# EAGLE design Schematique_TEST (EAGLE 7.6.0)
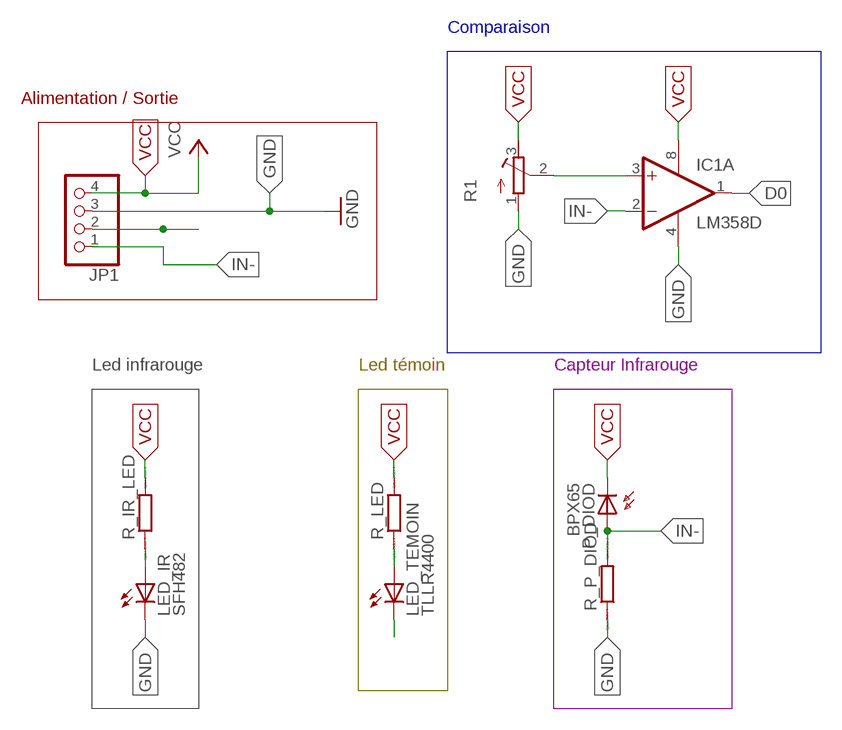
[diagram p0: schematic, sheet 1]

## Parts
IC1  LM358D  [SO08]
JP1  PINHD-1X4M  [1X04M]
LED_IR  SFH482  [SFH482]
LED_TEMOIN  TLLR4400  [LED3MM]
P_DIOD  BPX65  [BPX65]
R1  R-TRIMM4G/J  [RTRIM4G/J]
R_IR_LED  RR1206  [R1206]
R_LED  RR1206  [R1206]
R_P_DIOD  RR1206  [R1206]

## Nets
D0: IC1.1(A:OUT) JP1.2 LED_TEMOIN.K(C)
GND: IC1.4(P:V-) JP1.3 LED_IR.K(C) R1.1(A) R_P_DIOD.1
IN-: IC1.2(A:-IN) JP1.1 P_DIOD.A R_P_DIOD.2
N$1: LED_IR.A R_IR_LED.1
N$2: IC1.3(A:+IN) R1.2(S)
N$4: LED_TEMOIN.A R_LED.1
VCC: IC1.8(P:V+) JP1.4 P_DIOD.K(C) R1.3(E) R_IR_LED.2 R_LED.2
Unconnected: IC1.5(B:+IN) IC1.6(B:-IN) IC1.7(B:OUT)

## Buses
GND

## Notes on the sheet
- Comparaison
- Alimentation / Sortie
- Led infrarouge | Led témoin | Capteur Infrarouge

## Library data of the parts
IC1 = linear:LM358: OP AMP also LM158; LM258; LM2904 Source: http://cache.national.com/ds/LM/LM158.pdf
JP1 = pinhead:PINHD-1X4: PIN HEADER
LED_IR = led:SFH482: IR LED infrared emitting diode, Infineon
LED_TEMOIN = led:TLLR4400: Low Current (2mA) LED 3 mm Tinted Diffused Package color RED Source: Data sheet <http://www.farnell.com/datasheets/391100.pdf>; MF: VISHAY SEMICONDUCTOR; OC_FARNELL: 1612437
P_DIOD = opto-trans-siemens:BPX65: PHOTO DIODE; MPN: BPX65.; OC_FARNELL: 327451; OC_NEWARK: 06WX2764
R1 = rcl:R-TRIMM: Trimm resistor
R_IR_LED R_LED R_P_DIOD = eagle-ltspice:R: RESISTOR, European symbol; SPICEMODEL: NONE; SPICEPREFIX: R

## Board
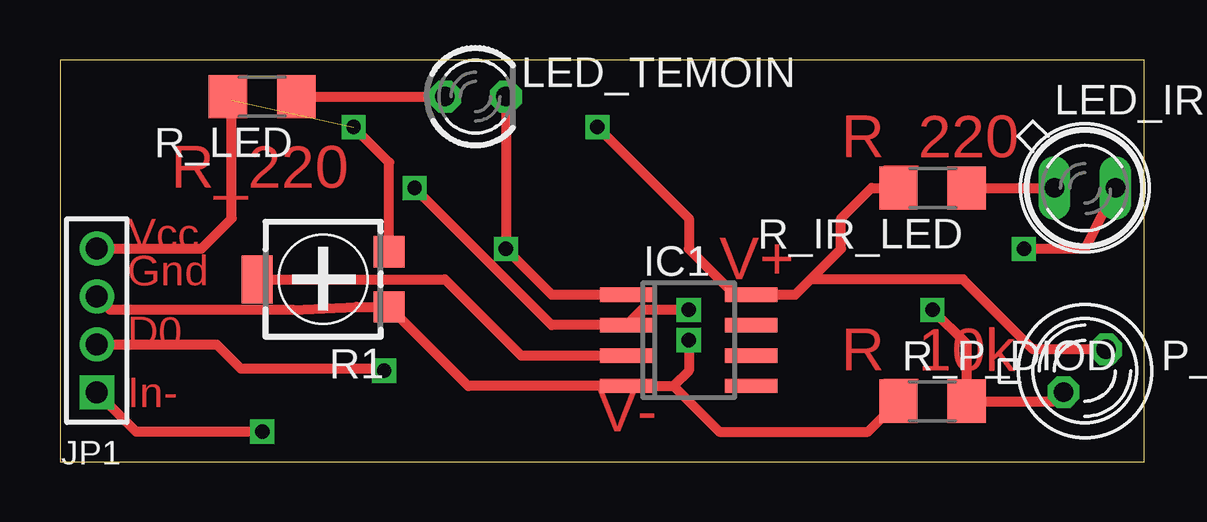
[diagram p1: board, top side]
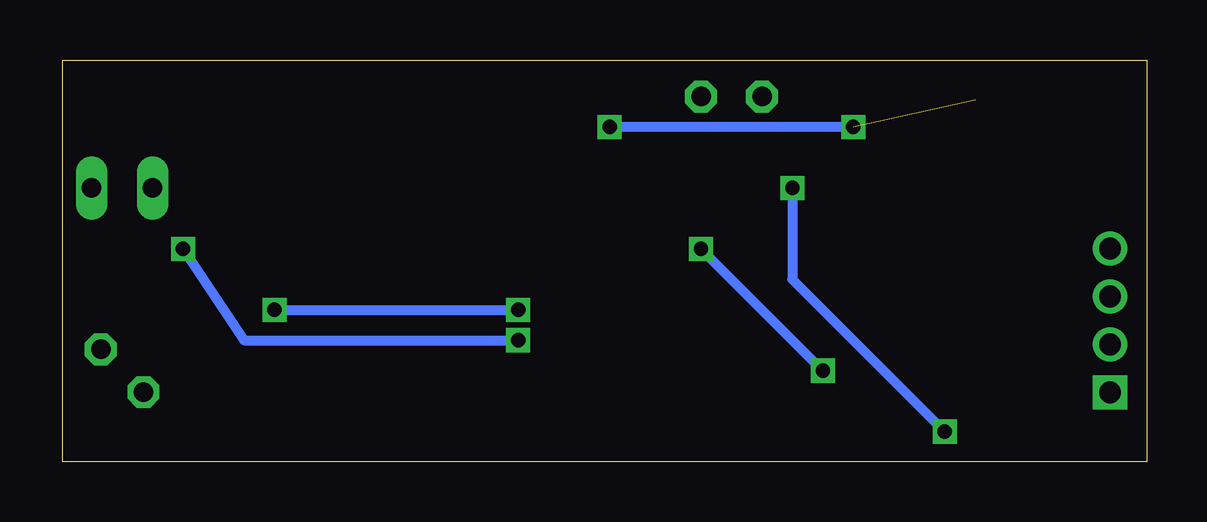
[diagram p2: board, bottom side, seen from below]

Size 45.2 x 16.77 mm. Coordinates in mm from the lower left corner, seen from the top.
Outline: 0,0 45.2,0 45.2,16.77 0,16.77 0,0
Copper layers (1*16): Top 0.035mm / dielectric 1.5mm / Bottom 0.035mm
Design rules "default": minimum track width 10mil, minimum drill 24mil, track to track 8mil, track to pad 8mil, pad to pad 8mil, via to via 8mil, smd to smd 8mil, copper to edge 40mil, drill to drill 8mil, minimum pad ring 10mil, minimum via ring 8mil, stop-mask expansion 4mil, vias tented up to drill 0mil, thermal gap 10mil

### Footprints (pad centres in the part's own frame; a part is rotated, then mirrored left to right if it is on the bottom)
SO08 = smd 0.6 x 2.2: 1 -1.905,-2.6; 2 -0.635,-2.6; 3 0.635,-2.6; 4 1.905,-2.6; 5 1.905,2.6; 6 0.635,2.6; 7 -0.635,2.6; 8 -1.905,2.6
1X04M = drill 0.914 square: 1 -3,0 | drill 0.914: 2 -1,0; 3 1,0; 4 3,0
SFH482 = drill 0.813 long: A -1.27,0; K 1.27,0
LED3MM = drill 0.813 octagon: A -1.27,0; K 1.27,0
BPX65 = drill 0.813 octagon: A -0.889,-0.889; K 0.889,0.889
RTRIM4G/J = smd 1.3 x 1.3: 1 -1.15,-2.75; 3 1.15,-2.75 | smd 2 x 1.3: 2 0,2.75
R1206 = smd 1.6 x 1.803: 1 -1.422,0; 2 1.422,0

### Placement (x,y rotation side)
IC1  26.21,5.08 270 top
JP1  1.54,5.9 90 top
LED_IR  42.72,11.43 0 top
LED_TEMOIN  17.32,15.24 0 top
P_DIOD  42.72,3.81 0 top
R1  10.97,7.62 90 top
R_IR_LED  36.37,11.43 180 top
R_LED  8.43,15.24 180 top
R_P_DIOD  36.37,2.54 0 top

### Tracks (layer width: path | path; a pad name or v marks a point on that pad's centre or on a via)
D0  (via drill 0.6)
  Top 0.406: LED_TEMOIN.K v18.59,8.89 20.49,6.98 IC1.1 | JP1.2 6.54,4.9 7.54,3.9 13.42,3.9 v13.51,3.81
  Bottom 0.406: v18.59,8.89 v13.51,3.81
GND  (via drill 0.6)
  Top 0.406: 25.57,3.17 IC1.4 17.02,3.17 R1.1 12.36,6.47 9.7,6.35 2.09,6.35 JP1.3 | 25.57,3.17 27.48,1.27 33.68,1.27 R_P_DIOD.1 | LED_IR.K 42.72,8.89 v40.18,8.89 | v26.21,5.08 26.21,3.81 25.57,3.17
  Bottom 0.406: v40.18,8.89 37.64,5.08 v26.21,5.08
IN-  (via drill 0.6)
  Top 0.406: v14.78,11.43 20.49,5.71 IC1.2 24.24,6.35 v26.21,6.35 | v36.37,6.35 37.79,4.93 R_P_DIOD.2 41.45,2.54 P_DIOD.A | v8.43,1.27 3.17,1.27 JP1.1
  Bottom 0.406: v14.78,11.43 14.78,7.62 v8.43,1.27 | v36.37,6.35 v26.21,6.35
N$1
  Top 0.406: R_IR_LED.1 LED_IR.A
N$2
  Top 0.406: R1.2 16.05,7.62 19.22,4.45 IC1.3
N$3  (via drill 0.6)
  other vias: 26.21,5.08
N$4
  Top 0.406: R_LED.1 LED_TEMOIN.A
VCC  (via drill 0.6)  (1 unrouted)
  Top 0.406: 13.6,8.89 R1.3 13.72,12.49 v12.24,13.97 | v22.4,13.97 26.21,10.16 26.21,8.89 28.11,6.98 IC1.8 30.65,6.98 31.29,7.62 | 31.29,7.62 32.56,8.89 32.56,10.16 33.83,11.43 R_IR_LED.2 | P_DIOD.K 40.56,4.7 37.64,7.62 31.29,7.62 | R_LED.2 7.16,15.09 7.16,10.16 5.89,8.89 JP1.4
  Bottom 0.406: v12.24,13.97 v22.4,13.97

### Text on the board
Top: R_220 | R_220 | Vcc | V+ | Gnd | D0 | R_10k | In- | V-